# EAGLE design M221X (EAGLE 6.6.0)
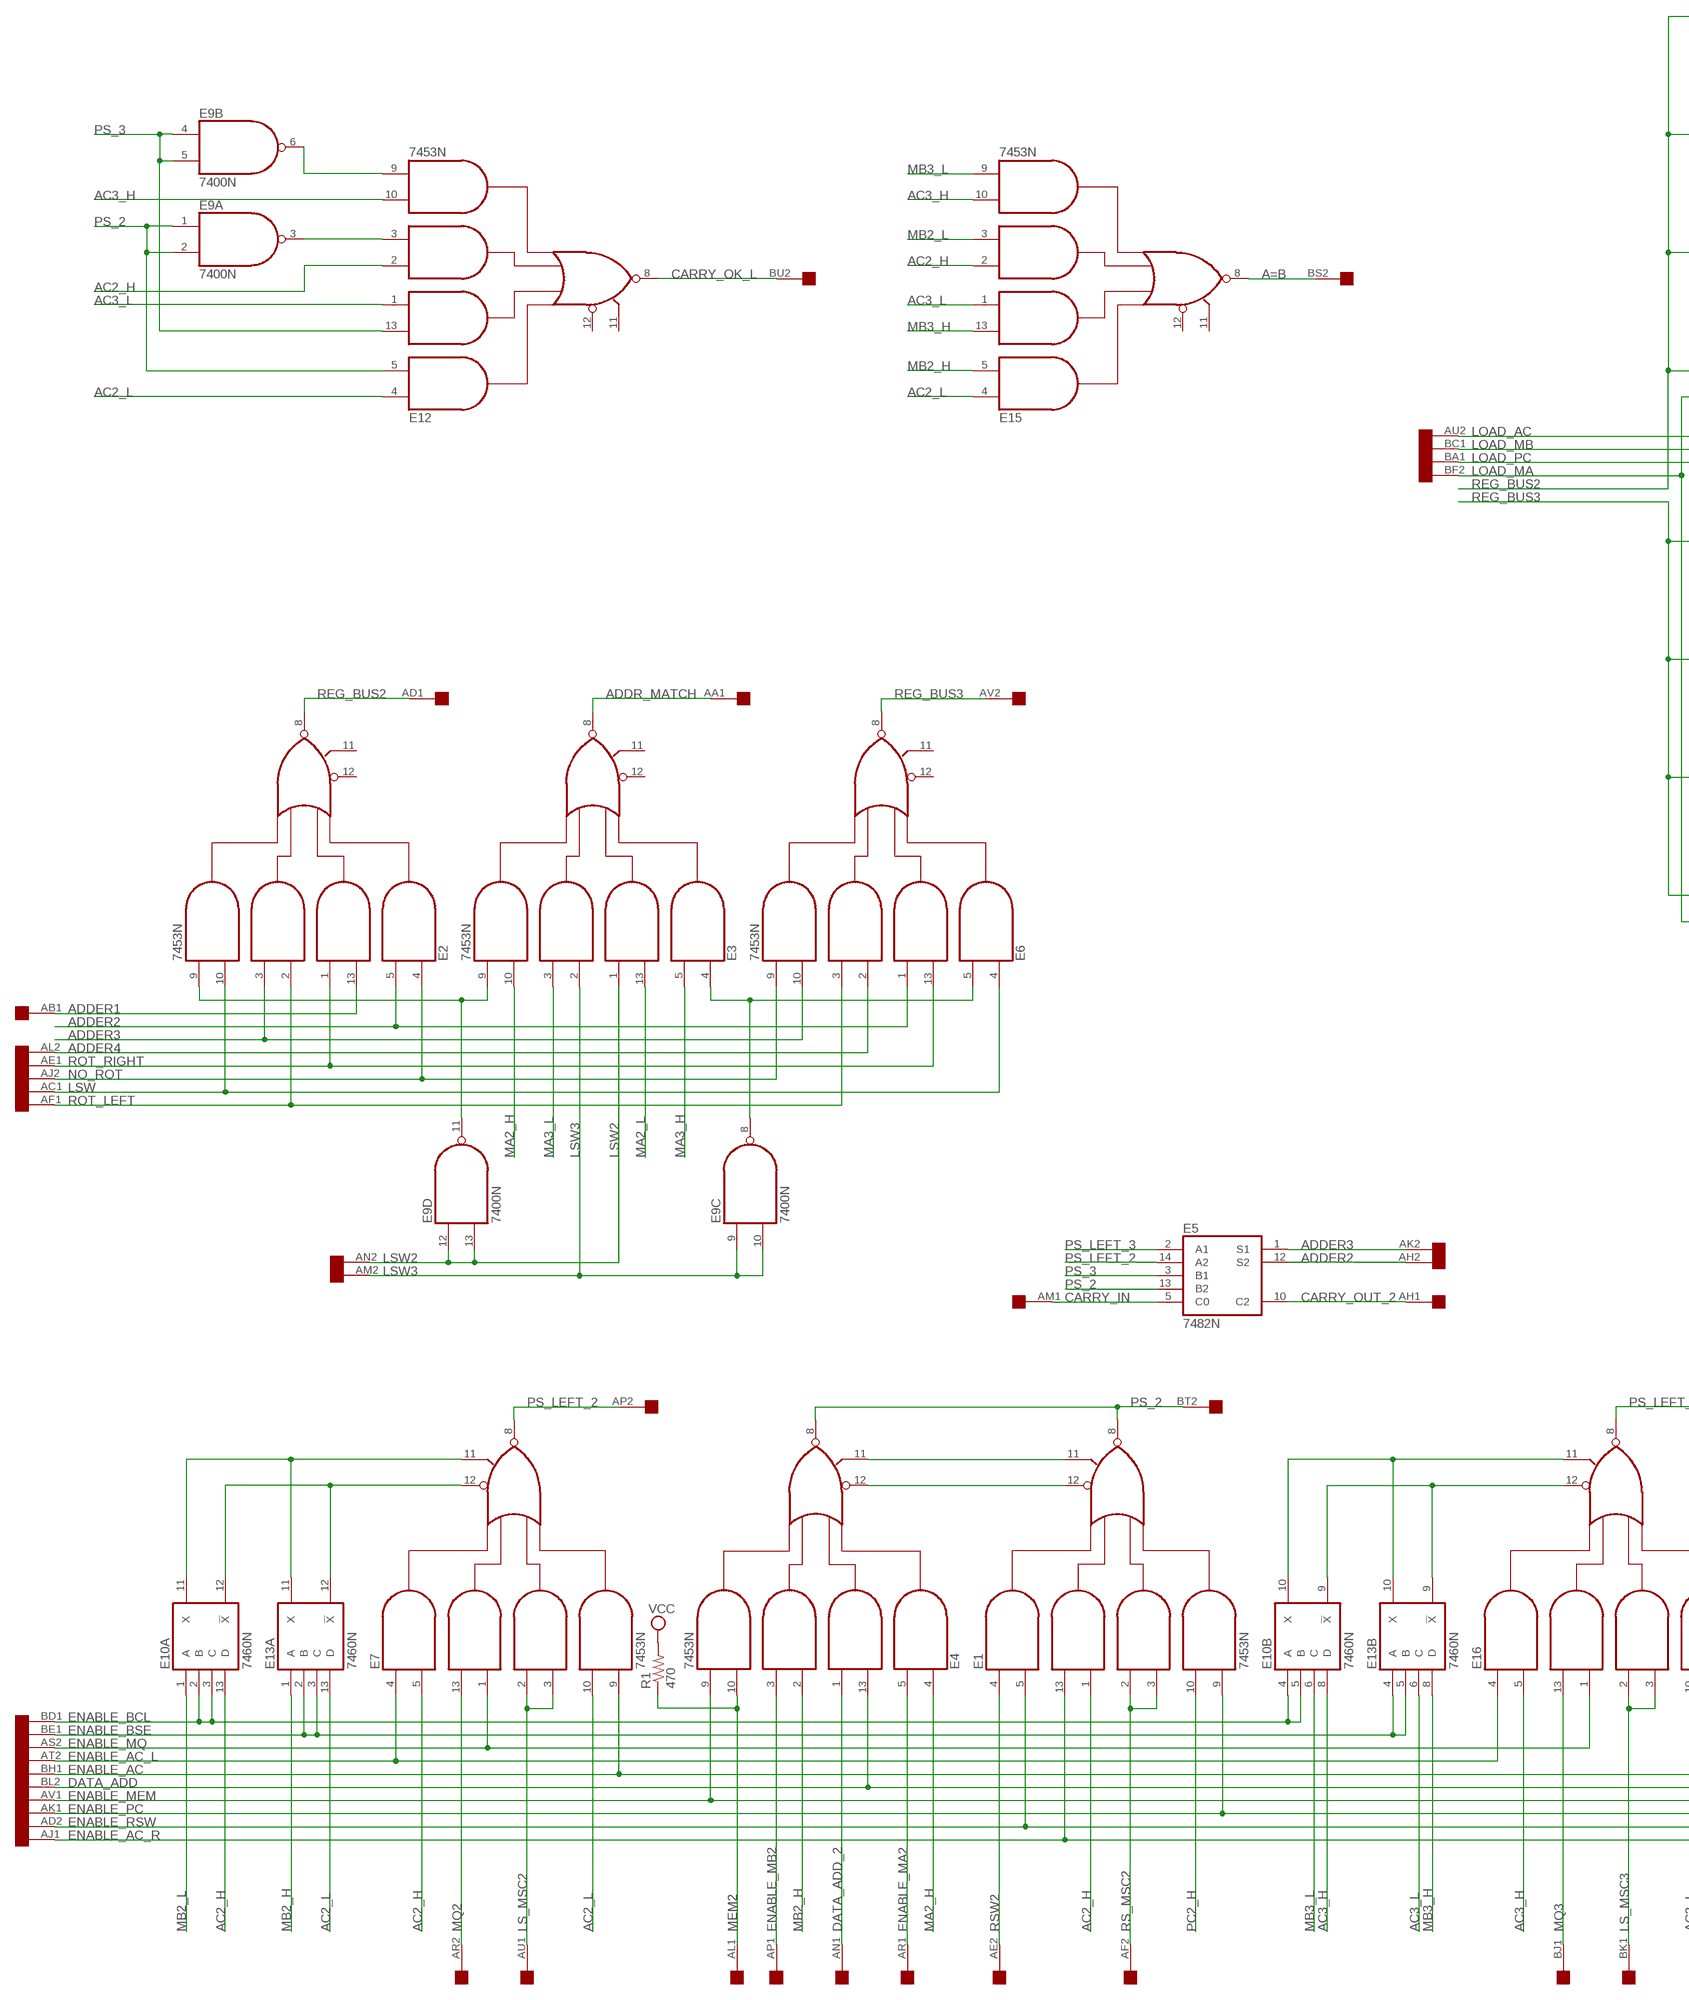
[diagram p0: schematic, sheet 1, part 1 of 2]
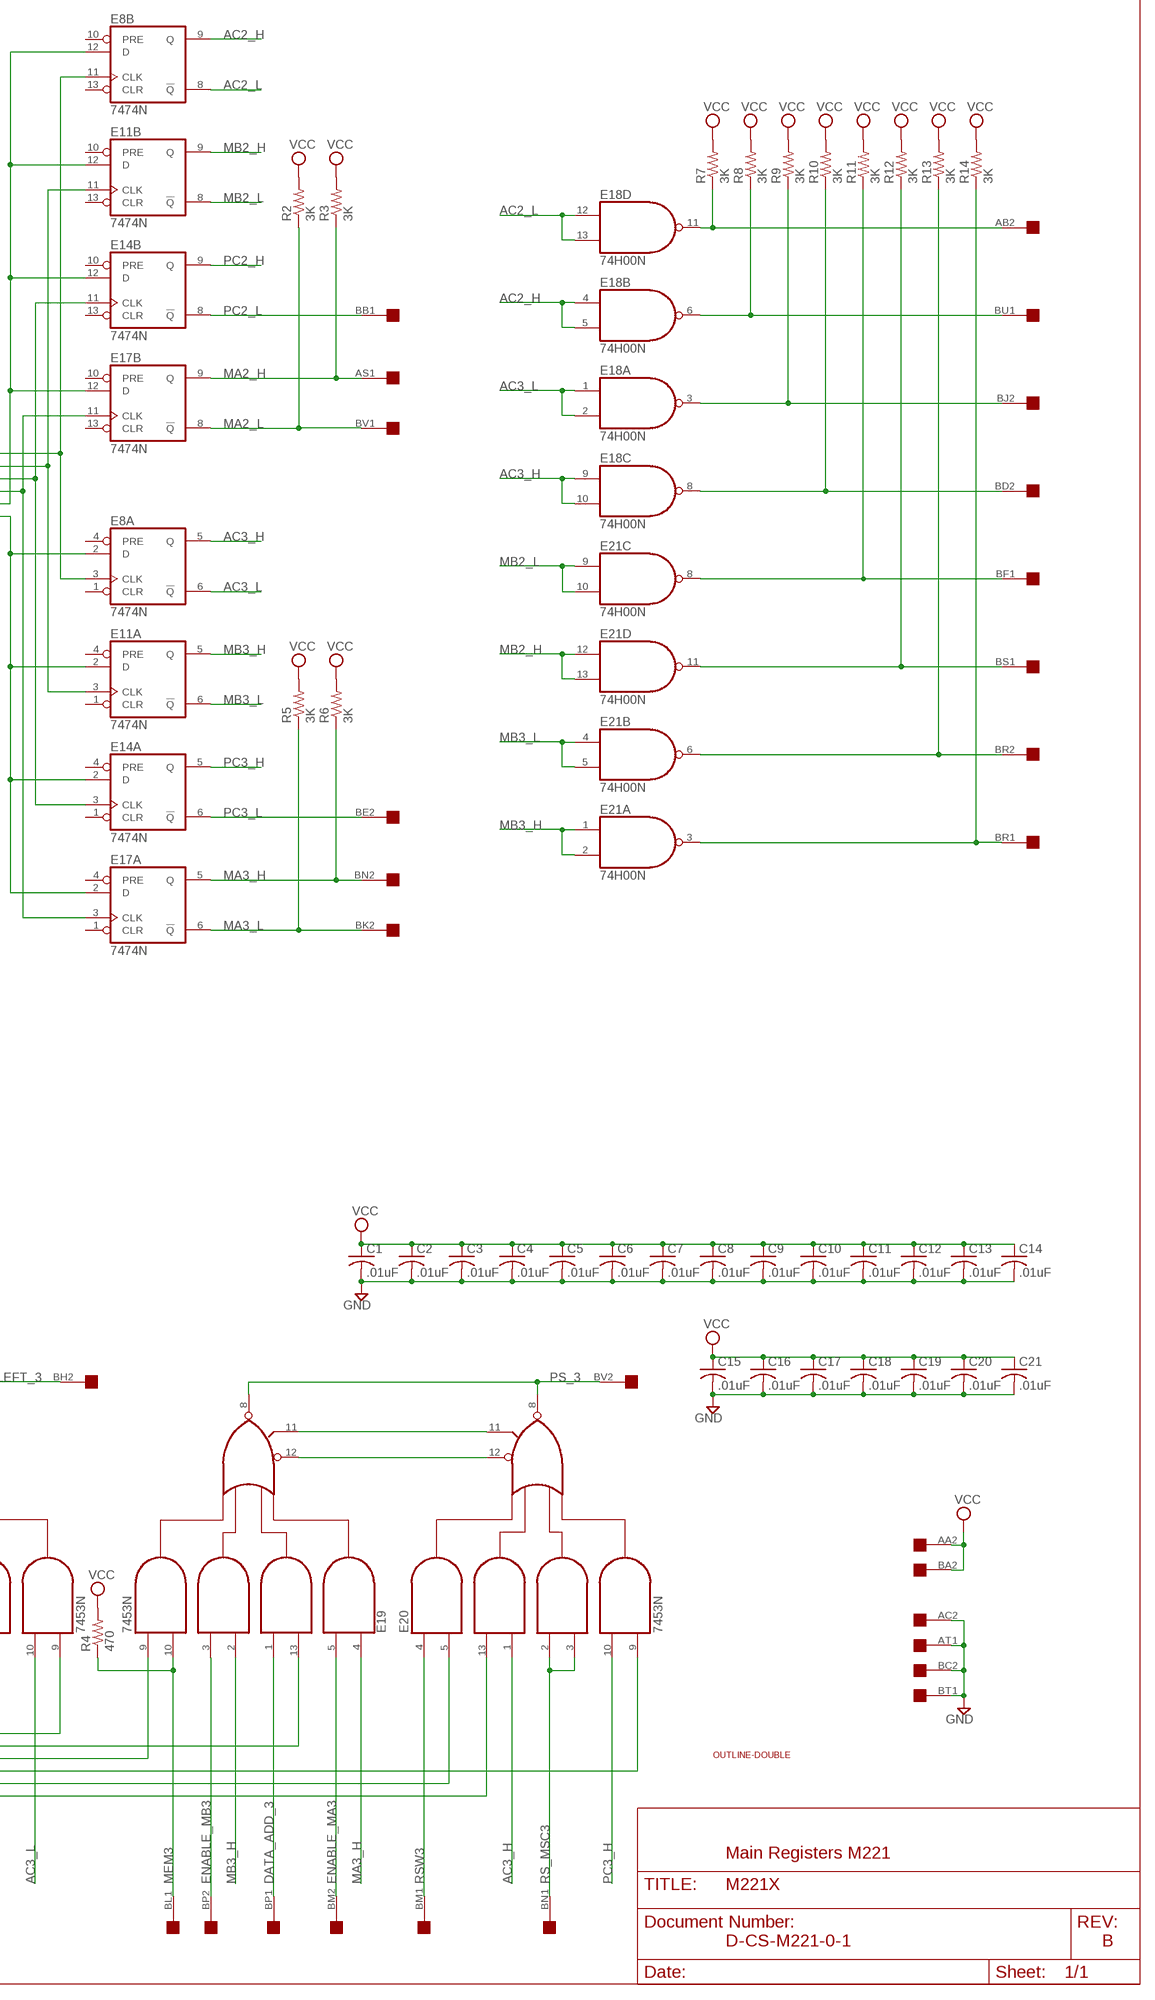
[diagram p1: schematic, sheet 1, part 2 of 2]

## Parts
C1  .01uF  C-US050-025X075  [C050-025X075]
C2  .01uF  C-US050-025X075  [C050-025X075]
C3  .01uF  C-US050-025X075  [C050-025X075]
C4  .01uF  C-US050-025X075  [C050-025X075]
C5  .01uF  C-US050-025X075  [C050-025X075]
C6  .01uF  C-US050-025X075  [C050-025X075]
C7  .01uF  C-US050-025X075  [C050-025X075]
C8  .01uF  C-US050-025X075  [C050-025X075]
C9  .01uF  C-US050-025X075  [C050-025X075]
C10  .01uF  C-US050-025X075  [C050-025X075]
C11  .01uF  C-US050-025X075  [C050-025X075]
C12  .01uF  C-US050-025X075  [C050-025X075]
C13  .01uF  C-US050-025X075  [C050-025X075]
C14  .01uF  C-US050-025X075  [C050-025X075]
C15  .01uF  C-US050-025X075  [C050-025X075]
C16  .01uF  C-US050-025X075  [C050-025X075]
C17  .01uF  C-US050-025X075  [C050-025X075]
C18  .01uF  C-US050-025X075  [C050-025X075]
C19  .01uF  C-US050-025X075  [C050-025X075]
C20  .01uF  C-US050-025X075  [C050-025X075]
C21  .01uF  C-US050-025X075  [C050-025X075]
E1  7453N  [DIL14]
E2  7453N  [DIL14]
E3  7453N  [DIL14]
E4  7453N  [DIL14]
E5  7482N  [DIL14]
E6  7453N  [DIL14]
E7  7453N  [DIL14]
E8  7474N  74S74N  [DIL14]
E9  7400N  [DIL14]
E10  7460N  [DIL14]
E11  7474N  74S74N  [DIL14]
E12  7453N  [DIL14]
E13  7460N  [DIL14]
E14  7474N  74S74N  [DIL14]
E15  7453N  [DIL14]
E16  7453N  [DIL14]
E17  7474N  74S74N  [DIL14]
E18  74H00N  7400N  [DIL14]
E19  7453N  [DIL14]
E20  7453N  [DIL14]
E21  74H00N  7400N  [DIL14]
R1  470  R-US_0207/10  [0207/10]
R2  3K  R-US_0207/10  [0207/10]
R3  3K  R-US_0207/10  [0207/10]
R4  470  R-US_0207/10  [0207/10]
R5  3K  R-US_0207/10  [0207/10]
R6  3K  R-US_0207/10  [0207/10]
R7  3K  R-US_0207/10  [0207/10]
R8  3K  R-US_0207/10  [0207/10]
R9  3K  R-US_0207/10  [0207/10]
R10  3K  R-US_0207/10  [0207/10]
R11  3K  R-US_0207/10  [0207/10]
R12  3K  R-US_0207/10  [0207/10]
R13  3K  R-US_0207/10  [0207/10]
R14  3K  R-US_0207/10  [0207/10]
U$1  DOUBLE  [EDGE-CON4]
U$2  OUTLINE-DOUBLE  [DOUBLE]

## Nets
!AC_2: E18.6(B:O) R8.1 U$1.BU1
!AC_3: E18.8(C:O) R10.1 U$1.BD2
!MB_2: E21.11(D:O) R12.1 U$1.BS1
!MB_3: E21.3(A:O) R14.1 U$1.BR1
A=B: E15.8(O) U$1.BS2
AC2_H: E1.1(I4) E7.5(I2) E8.9(B:Q) E10.13(A:D) E12.2(I5) E15.2(I5) E18.4(B:I0) E18.5(B:I1)
AC2_L: E7.10(I7) E8.8(B:!Q) E12.4(I1) E13.13(A:D) E15.4(I1) E18.12(D:I0) E18.13(D:I1)
AC3_H: E8.5(A:Q) E10.8(B:D) E12.10(I7) E15.10(I7) E16.5(I2) E18.9(C:I0) E18.10(C:I1) E20.1(I4)
AC3_L: E8.6(A:!Q) E12.1(I4) E13.6(B:C) E15.1(I4) E16.10(I7) E18.1(A:I0) E18.2(A:I1)
AC_2: E18.11(D:O) R7.1 U$1.AB2
AC_3: E18.3(A:O) R9.1 U$1.BJ2
ADDER1: E2.13(I3) U$1.AB1
ADDER2: E2.5(I2) E5.12(S2) E6.1(I4) U$1.AH2
ADDER3: E2.3(I6) E5.1(S1) E6.10(I7) U$1.AK2
ADDER4: E6.2(I5) U$1.AL2
ADDR_MATCH: E3.8(O) U$1.AA1
CARRY_IN: E5.5(C0) U$1.AM1
CARRY_OK_L: E12.8(O) U$1.BU2
CARRY_OUT_2: E5.10(C2) U$1.AH1
DATA_ADD: E4.13(I3) E19.13(I3) U$1.BL2
DATA_ADD_2: E4.1(I4) U$1.AN1
DATA_ADD_3: E19.1(I4) U$1.BP1
ENABLE_AC: E7.9(I8) E16.9(I8) U$1.BH1
ENABLE_AC_L: E7.4(I1) E16.4(I1) U$1.AT2
ENABLE_AC_R: E1.13(I3) E20.13(I3) U$1.AJ1
ENABLE_BCL: E10.2(A:B) E10.3(A:C) E10.4(B:A) E10.5(B:B) U$1.BD1
ENABLE_BSE: E13.2(A:B) E13.3(A:C) E13.4(B:A) E13.5(B:B) U$1.BE1
ENABLE_MA2: E4.5(I2) U$1.AR1
ENABLE_MA3: E19.5(I2) U$1.BM2
ENABLE_MB2: E4.3(I6) U$1.AP1
ENABLE_MB3: E19.3(I6) U$1.BP2
ENABLE_MEM: E4.9(I8) E19.9(I8) U$1.AV1
ENABLE_MQ: E7.1(I4) E16.1(I4) U$1.AS2
ENABLE_PC: E1.9(I8) E20.9(I8) U$1.AK1
ENABLE_RSW: E1.5(I2) E20.5(I2) U$1.AD2
GND [Supply]: C1.2 C2.2 C3.2 C4.2 C5.2 C6.2 C7.2 C8.2 C9.2 C10.2 C11.2 C12.2 C13.2 C14.2 C15.2 C16.2 C17.2 C18.2 C19.2 C20.2 C21.2 U$1.AC2 U$1.AT1 U$1.BC2 U$1.BT1
LOAD_AC: E8.3(A:CLK) E8.11(B:CLK) U$1.AU2
LOAD_MA: E17.3(A:CLK) E17.11(B:CLK) U$1.BF2
LOAD_MB: E11.3(A:CLK) E11.11(B:CLK) U$1.BC1
LOAD_PC: E14.3(A:CLK) E14.11(B:CLK) U$1.BA1
LS_MSC2: E7.2(I5) E7.3(I6) U$1.AU1
LS_MSC3: E16.2(I5) E16.3(I6) U$1.BK1
LSW: E2.10(I7) E6.4(I1) U$1.AC1
LSW2: E3.1(I4) E9.12(D:I0) E9.13(D:I1) U$1.AN2
LSW3: E3.2(I5) E9.9(C:I0) E9.10(C:I1) U$1.AM2
MA2_H: E3.10(I7) E4.4(I1) E17.9(B:Q) R3.1 U$1.AS1
MA2_L: E3.13(I3) E17.8(B:!Q) R2.1 U$1.BV1
MA3_H: E3.5(I2) E17.5(A:Q) E19.4(I1) R6.1 U$1.BN2
MA3_L: E3.3(I6) E17.6(A:!Q) R5.1 U$1.BK2
MB2_H: E4.2(I5) E11.9(B:Q) E13.1(A:A) E15.5(I2) E21.12(D:I0) E21.13(D:I1)
MB2_L: E10.1(A:A) E11.8(B:!Q) E15.3(I6) E21.9(C:I0) E21.10(C:I1)
MB3_H: E11.5(A:Q) E13.8(B:D) E15.13(I3) E19.2(I5) E21.1(A:I0) E21.2(A:I1)
MB3_L: E10.6(B:C) E11.6(A:!Q) E15.9(I8) E21.4(B:I0) E21.5(B:I1)
MB_2: E21.8(C:O) R11.1 U$1.BF1
MB_3: E21.6(B:O) R13.1 U$1.BR2
MEM2: E4.10(I7) R1.1 U$1.AL1
MEM3: E19.10(I7) R4.1 U$1.BL1
MQ2: E7.13(I3) U$1.AR2
MQ3: E16.13(I3) U$1.BJ1
N$1: E10.10(B:X) E13.10(B:X) E16.11(I10)
N$2: E10.9(B:!X) E13.9(B:!X) E16.12(I9)
N$3: E1.11(I10) E4.11(I10)
N$4: E1.12(I9) E4.12(I9)
N$5: E7.12(I9) E10.12(A:!X) E13.12(A:!X)
N$6: E7.11(I10) E10.11(A:X) E13.11(A:X)
N$7: E19.12(I9) E20.12(I9)
N$8: E19.11(I10) E20.11(I10)
N$9: E2.9(I8) E3.9(I8) E9.11(D:O)
N$10: E3.4(I1) E6.5(I2) E9.8(C:O)
N$19: E9.3(A:O) E12.3(I6)
N$20: E9.6(B:O) E12.9(I8)
NO_ROT: E2.4(I1) E6.9(I8) U$1.AJ2
PC2_H: E1.10(I7) E14.9(B:Q)
PC2_L: E14.8(B:!Q) U$1.BB1
PC3_H: E14.5(A:Q) E20.10(I7)
PC3_L: E14.6(A:!Q) U$1.BE2
PS_2: E1.8(O) E4.8(O) E5.13(B2) E9.1(A:I0) E9.2(A:I1) E12.5(I2) U$1.BT2
PS_3: E5.3(B1) E9.4(B:I0) E9.5(B:I1) E12.13(I3) E19.8(O) E20.8(O) U$1.BV2
PS_LEFT_2: E5.14(A2) E7.8(O) U$1.AP2
PS_LEFT_3: E5.2(A1) E16.8(O) U$1.BH2
REG_BUS2: E2.8(O) E8.12(B:D) E11.12(B:D) E14.12(B:D) E17.12(B:D) U$1.AD1
REG_BUS3: E6.8(O) E8.2(A:D) E11.2(A:D) E14.2(A:D) E17.2(A:D) U$1.AV2
ROT_LEFT: E2.2(I5) E6.3(I6) U$1.AF1
ROT_RIGHT: E2.1(I4) E6.13(I3) U$1.AE1
RS_MSC2: E1.2(I5) E1.3(I6) U$1.AF2
RS_MSC3: E20.2(I5) E20.3(I6) U$1.BN1
RSW2: E1.4(I1) U$1.AE2
RSW3: E20.4(I1) U$1.BM1
VCC [Supply]: C1.1 C2.1 C3.1 C4.1 C5.1 C6.1 C7.1 C8.1 C9.1 C10.1 C11.1 C12.1 C13.1 C14.1 C15.1 C16.1 C17.1 C18.1 C19.1 C20.1 C21.1 R1.2 R2.2 R3.2 R4.2 R5.2 R6.2 R7.2 R8.2 R9.2 R10.2 R11.2 R12.2 R13.2 R14.2 U$1.AA2 U$1.BA2
Unconnected: E1.6(SPARE) E2.6(SPARE) E2.11(I10) E2.12(I9) E3.6(SPARE) E3.11(I10) E3.12(I9) E4.6(SPARE) E5.6 E5.7 E5.8 E5.9 E6.6(SPARE) E6.11(I10) E6.12(I9) E7.6(SPARE) E8.1(A:CLR) E8.4(A:PRE) E8.10(B:PRE) E8.13(B:CLR) E11.1(A:CLR) E11.4(A:PRE) E11.10(B:PRE) E11.13(B:CLR) E12.6(SPARE) E12.11(I10) E12.12(I9) E14.1(A:CLR) E14.4(A:PRE) E14.10(B:PRE) E14.13(B:CLR) E15.6(SPARE) E15.11(I10) E15.12(I9) E16.6(SPARE) E17.1(A:CLR) E17.4(A:PRE) E17.10(B:PRE) E17.13(B:CLR) E19.6(SPARE) E20.6(SPARE) U$1.BB2

## Notes on the sheet
- Main Registers M221
- D-CS-M221-0-1 | B

## Power pins joined to a net without a drawn wire
GND: E1.7(GND) E2.7(GND) E3.7(GND) E4.7(GND) E5.11(GND) E6.7(GND) E7.7(GND) E8.7(P:GND) E9.7(P:GND) E10.7(P:GND) E11.7(P:GND) E12.7(GND) E13.7(P:GND) E14.7(P:GND) E15.7(GND) E16.7(GND) E17.7(P:GND) E18.7(P:GND) E19.7(GND) E20.7(GND) E21.7(P:GND)
VCC: E1.14(VCC) E2.14(VCC) E3.14(VCC) E4.14(VCC) E5.4(VCC) E6.14(VCC) E7.14(VCC) E8.14(P:VCC) E9.14(P:VCC) E10.14(P:VCC) E11.14(P:VCC) E12.14(VCC) E13.14(P:VCC) E14.14(P:VCC) E15.14(VCC) E16.14(VCC) E17.14(P:VCC) E18.14(P:VCC) E19.14(VCC) E20.14(VCC) E21.14(P:VCC)

## Library data of the parts
C1-C21 = rcl:C-US: CAPACITOR, American symbol
E1-E4 E6 E7 E12 E15 E16 E19 E20 = dec-con:74*53: 4-2-3-2 input AND OR INVERTER gates
E5 = dec-con:74*82: 2-bit binary full ADDER Has the wrong GND pin in other libraries.
E8 E11 E14 E17 = 74xx-us:74*74: Dual D type positive edge triggered FLIP FLOP, preset and clear
E9 E18 E21 = 74xx-us:74*00: Quad 2-input NAND gate
E10 E13 = 74xx-us:74*60: Dual 4-input EXPANDER
R1-R14 = rcl:R-US_: RESISTOR, American symbol
U$1 = dec-con:DOUBLE: Double-Height DEC board
U$2 = dec-con:OUTLINE-*: Board outlines for DEC boards.

## Net classes
1 Supply: width 0.813 mm

## Board
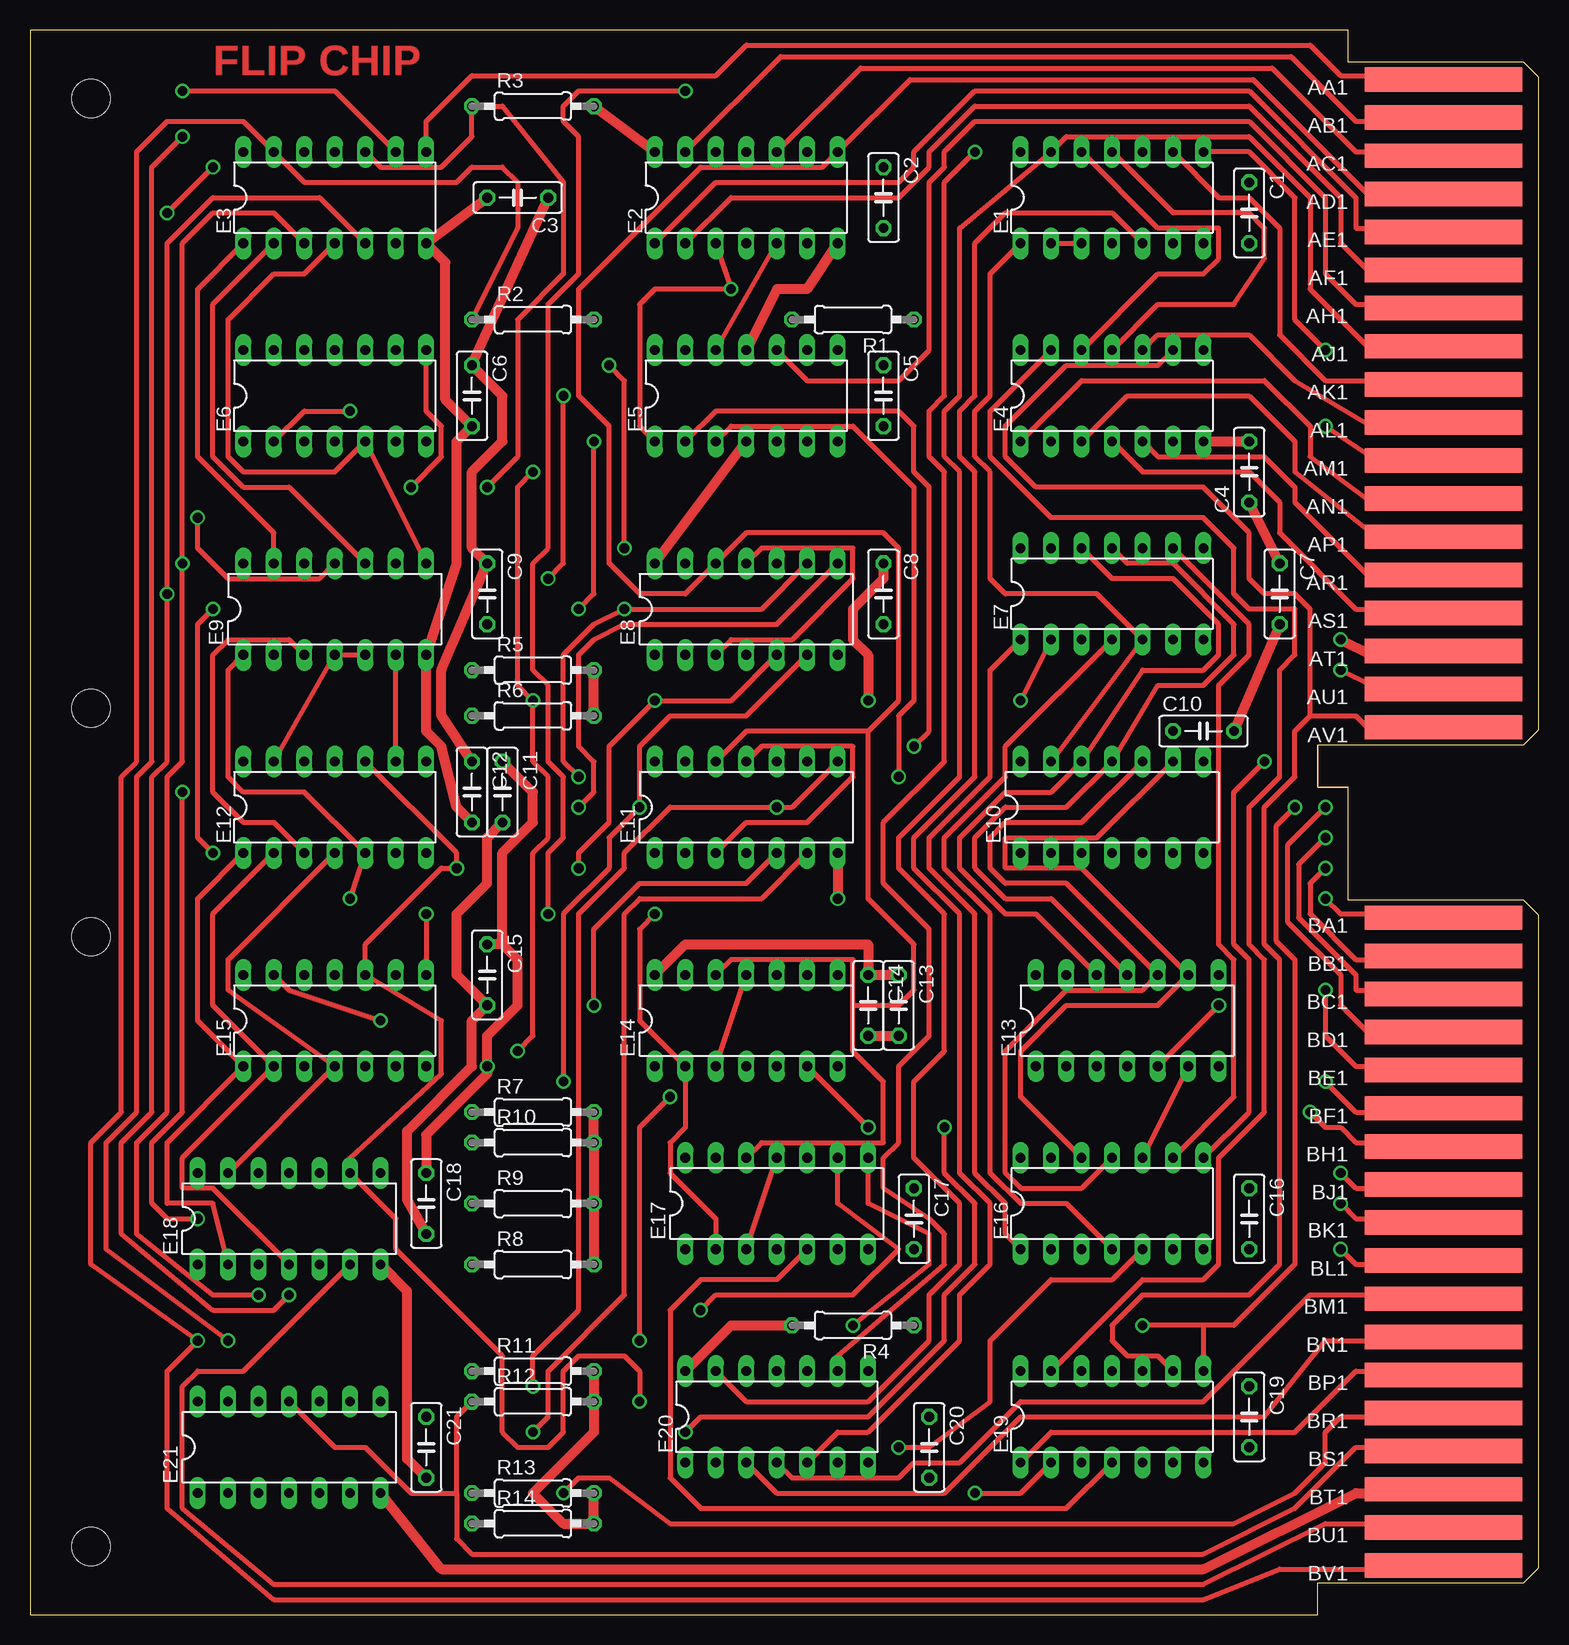
[diagram p2: board, top side]
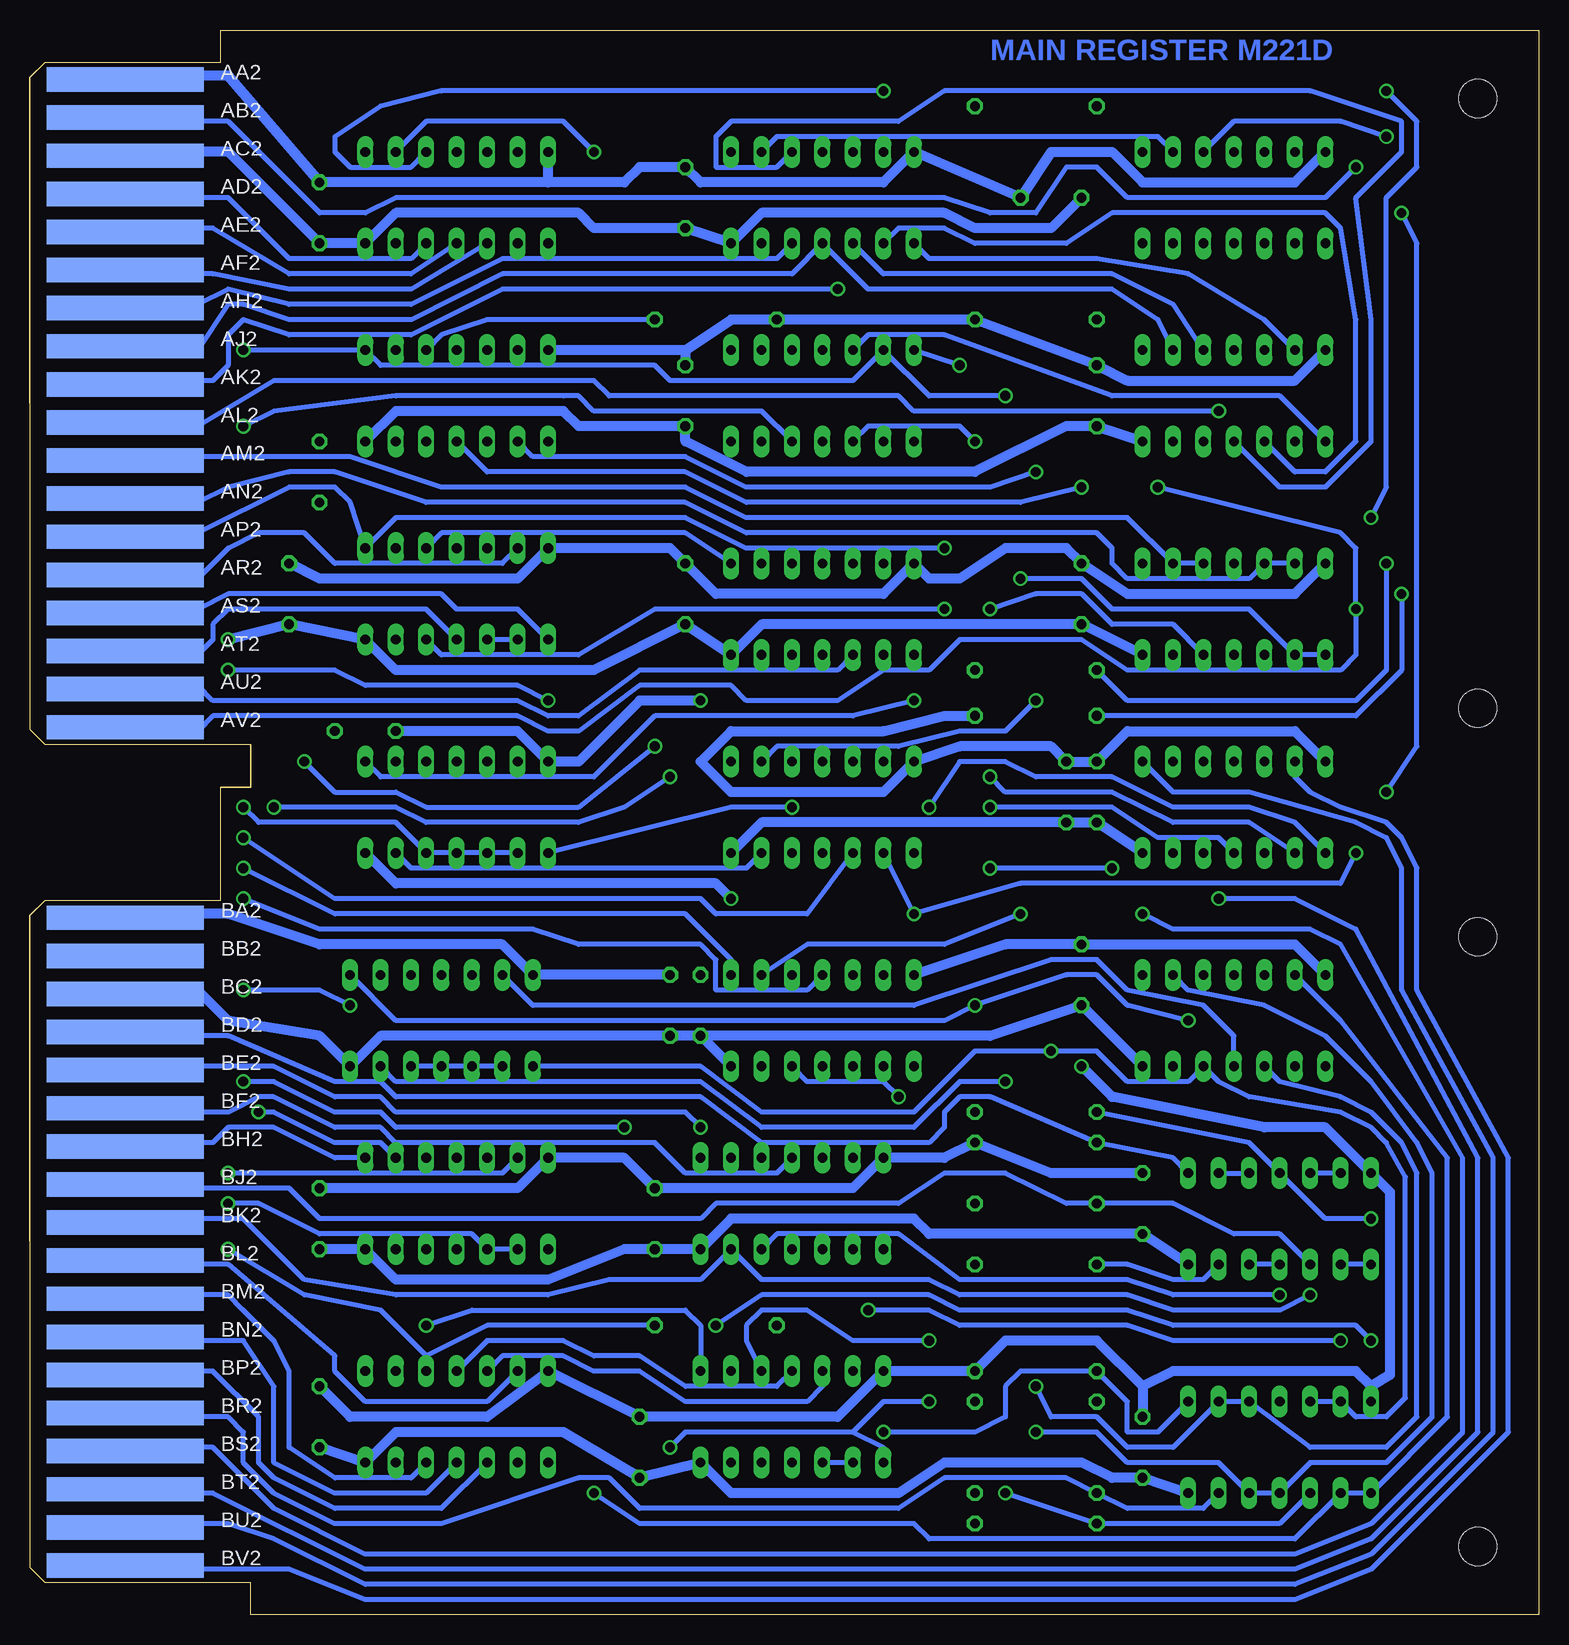
[diagram p3: board, bottom side, seen from below]

Size 125.73 x 132.08 mm. Coordinates in mm from the lower left corner, seen from the top.
Copper layers (1+16): Top 0.035mm / dielectric 1.5mm / Bottom 0.035mm
Design rules "16mils": minimum track width 16mil, minimum drill 32mil, track to track 15mil, track to pad 10mil, pad to pad 10mil, via to via 10mil, smd to smd 10mil, copper to edge 13mil, drill to drill 10mil, minimum pad ring 10mil, minimum via ring 8mil, stop-mask expansion 0mil, vias tented up to drill 0mil, thermal gap 10mil

### Footprints (pad centres in the part's own frame; a part is rotated, then mirrored left to right if it is on the bottom)
C050-025X075 = drill 0.813 octagon: 1 -2.54,0; 2 2.54,0
DIL14 = drill 0.813 long: 1 -7.62,-3.81; 2 -5.08,-3.81; 3 -2.54,-3.81; 4 0,-3.81; 5 2.54,-3.81; 6 5.08,-3.81; 7 7.62,-3.81; 8 7.62,3.81; 9 5.08,3.81; 10 2.54,3.81; 11 0,3.81; 12 -2.54,3.81; 13 -5.08,3.81; 14 -7.62,3.81
0207/10 = drill 0.813 octagon: 1 -5.08,0; 2 5.08,0
EDGE-CON4 = smd 13.106 x 2.032: AA1 7.938,4.128; AB1 7.938,7.303; AC1 7.938,10.477; AD1 7.938,13.652; AE1 7.938,16.828; AF1 7.938,20.003; AH1 7.938,23.177; AJ1 7.938,26.352; AK1 7.938,29.527; AL1 7.938,32.703; AM1 7.938,35.877; AN1 7.938,39.053; AP1 7.938,42.227; AR1 7.938,45.403; AS1 7.938,48.578; AT1 7.938,51.752; AU1 7.938,54.928; AV1 7.938,58.102; BA1 7.938,73.978; BB1 7.938,77.153; BC1 7.938,80.328; BD1 7.938,83.502; BE1 7.938,86.677; BF1 7.938,89.853; BH1 7.938,93.028; BJ1 7.938,96.203; BK1 7.938,99.377; BL1 7.938,102.552; BM1 7.938,105.728; BN1 7.938,108.903; BP1 7.938,112.078; BR1 7.938,115.252; BS1 7.938,118.427; BT1 7.938,121.603; BU1 7.938,124.778; BV1 7.938,127.953 | smd 13.106 x 2.032 bottom: AA2 7.938,4.128; AB2 7.938,7.303; AC2 7.938,10.477; AD2 7.938,13.652; AE2 7.938,16.828; AF2 7.938,20.003; AH2 7.938,23.177; AJ2 7.938,26.352; AK2 7.938,29.527; AL2 7.938,32.703; AM2 7.938,35.877; AN2 7.938,39.053; AP2 7.938,42.227; AR2 7.938,45.403; AS2 7.938,48.578; AT2 7.938,51.752; AU2 7.938,54.928; AV2 7.938,58.102; BA2 7.938,73.978; BB2 7.938,77.153; BC2 7.938,80.328; BD2 7.938,83.502; BE2 7.938,86.677; BF2 7.938,89.853; BH2 7.938,93.028; BJ2 7.938,96.203; BK2 7.938,99.377; BL2 7.938,102.552; BM2 7.938,105.728; BN2 7.938,108.903; BP2 7.938,112.078; BR2 7.938,115.252; BS2 7.938,118.427; BT2 7.938,121.603; BU2 7.938,124.778; BV2 7.938,127.953
DOUBLE = hole 3.175: 120.65,56.515; 120.65,5.715; 120.65,75.565; 120.65,126.365

### Placement (x,y rotation side)
C1  101.6,116.84 270 top
C2  71.12,118.11 270 top
C3  40.64,118.11 180 top
C4  101.6,95.25 90 top
C5  71.12,101.6 270 top
C6  36.83,101.6 270 top
C7  104.14,85.09 270 top
C8  71.12,85.09 270 top
C9  38.1,85.09 270 top
C10  97.79,73.66 0 top
C11  39.37,68.58 270 top
C12  36.83,68.58 270 top
C13  72.39,50.8 270 top
C14  69.85,50.8 270 top
C15  38.1,53.34 270 top
C16  101.6,33.02 270 top
C17  73.66,33.02 270 top
C18  33.02,34.29 270 top
C19  101.6,16.51 270 top
C20  74.93,13.97 270 top
C21  33.02,13.97 270 top
E1  90.17,118.11 0 top
E2  59.69,118.11 0 top
E3  25.4,118.11 0 top
E4  90.17,101.6 0 top
E5  59.69,101.6 0 top
E6  25.4,101.6 0 top
E7  90.17,85.09 0 top
E8  59.69,83.82 0 top
E9  25.4,83.82 0 top
E10  90.17,67.31 0 top
E11  59.69,67.31 0 top
E12  25.4,67.31 0 top
E13  91.44,49.53 0 top
E14  59.69,49.53 0 top
E15  25.4,49.53 0 top
E16  90.17,34.29 0 top
E17  62.23,34.29 0 top
E18  21.59,33.02 0 top
E19  90.17,16.51 0 top
E20  62.23,16.51 0 top
E21  21.59,13.97 0 top
R1  68.58,107.95 180 top
R2  41.91,107.95 0 top
R3  41.91,125.73 0 top
R4  68.58,24.13 180 top
R5  41.91,78.74 0 top
R6  41.91,74.93 0 top
R7  41.91,41.91 0 top
R8  41.91,29.21 0 top
R9  41.91,34.29 0 top
R10  41.91,39.37 0 top
R11  41.91,20.32 0 top
R12  41.91,17.78 0 top
R13  41.91,10.16 0 top
R14  41.91,7.62 0 top
U$1  125.73,132.08 180 top
U$2  125.73,132.08 180 top

### Tracks (layer width: path | path; a pad name or v marks a point on that pad's centre or on a via)
!AC_2
  Top 0.406: U$1.BU1 116.84,7.62 107.95,7.62 97.79,2.54 20.32,2.54 12.7,8.89 12.7,19.05 13.97,20.32 17.78,20.32 E18.6
  Bottom 0.406: E18.6 27.94,27.94 30.48,27.94 34.29,29.21 R8.1
!AC_3
  Bottom 0.406: E18.8 30.48,38.1 R10.1 45.72,43.18 48.26,43.18 49.53,41.91 49.53,40.64 50.8,39.37 64.77,39.37 69.85,43.18 95.25,43.18 96.52,44.45 100.33,44.45 109.22,48.26 116.84,48.26 U$1.BD2
!MB_2
  Top 0.406: E21.11 25.4,13.97 27.94,13.97 31.75,10.16 35.56,10.16 | 35.56,10.16 35.56,16.51 R12.1 | 35.56,10.16 35.56,6.35 36.83,5.08 97.79,5.08 105.41,8.89 110.49,13.97 116.84,13.97 U$1.BS1
!MB_3  (via drill 0.81)
  Top 0.406: U$1.BR1 116.84,16.51 109.22,16.51 107.95,15.24 107.95,12.7 105.41,10.16 100.33,7.62 53.34,7.62 48.26,11.43 45.72,11.43 v44.45,10.16
  Bottom 0.406: E21.3 21.59,7.62 R14.1 v44.45,10.16
A=B  (via drill 0.81)
  Top 0.406: v33.02,58.42 E15.8
  Bottom 0.406: U$1.BS2 116.84,13.97 110.49,13.97 105.41,8.89 97.79,5.08 20.32,5.08 13.97,7.62 6.35,15.24 6.35,38.1 16.51,55.88 19.05,57.15 30.48,57.15 v33.02,58.42
AC2_H  (via drill 0.81)
  Top 0.406: E10.13 E7.5 88.9,85.09 81.28,85.09 80.01,86.36 80.01,95.25 78.74,96.52 78.74,100.33 80.01,101.6 80.01,111.76 E1.1 | E12.2 15.24,58.42 15.24,50.8 E15.2 12.7,38.1 12.7,35.56 15.24,35.56 E18.4 | v45.72,69.85 44.45,71.12 44.45,80.01 46.99,82.55 v49.53,83.82 60.96,83.82 E8.9
  Bottom 0.406: E18.4 E18.5 | E12.2 24.13,66.04 30.48,66.04 35.56,68.58 44.45,68.58 v45.72,69.85 | v49.53,83.82 73.66,83.82 80.01,80.01 91.44,80.01 E7.5
AC2_L  (via drill 0.81)
  Top 0.406: E12.4 16.51,54.61 16.51,52.07 E15.4 E18.13 | v45.72,67.31 46.99,68.58 46.99,71.12 45.72,72.39 45.72,80.01 46.99,81.28 49.53,82.55 62.23,82.55 E8.8
  Bottom 0.406: E18.13 E18.12 | E15.4 25.4,48.26 27.94,50.8 34.29,52.07 36.83,54.61 40.64,54.61 52.07,50.8 83.82,50.8 E13.13 | E12.4 26.67,64.77 31.75,64.77 35.56,67.31 v45.72,67.31 | E8.8 71.12,90.17 91.44,90.17 E7.10
AC3_H  (via drill 0.81)
  Top 0.406: v50.8,17.78 50.8,20.32 49.53,21.59 45.72,21.59 44.45,20.32 44.45,15.24 43.18,13.97 40.64,13.97 39.37,15.24 39.37,21.59 30.48,30.48 30.48,33.02 E18.9 26.67,38.1 34.29,45.09 34.29,49.53 E15.10 27.94,55.88 34.29,62.23 v35.56,62.23 35.56,63.5 E12.10 | v72.39,13.97 74.93,13.97 80.01,17.78 80.01,22.86 85.09,27.94 90.17,27.94 E16.5 | v45.72,62.23 45.72,63.5 48.26,66.04 48.26,72.39 v52.07,76.2 58.42,76.2 E8.5
  Bottom 0.406: E18.9 E18.10 | E20.1 54.61,13.97 57.15,15.24 | 57.15,15.24 54.61,17.78 v50.8,17.78 | 57.15,15.24 71.12,15.24 v72.39,13.97 | v35.56,62.23 v45.72,62.23 | E10.8 96.52,69.85 78.74,69.85 73.66,74.93 57.15,74.93 v52.07,76.2
AC3_L  (via drill 0.81)
  Top 0.406: E13.6 E16.10 | E12.1 13.97,59.69 13.97,49.53 E15.1 11.43,39.37 11.43,34.29 15.24,34.29 E18.2 | v44.45,44.45 44.45,58.42 48.26,62.23 48.26,64.77 v50.8,67.31 50.8,72.39 53.34,74.93 59.69,74.93 E8.6
  Bottom 0.406: E18.1 E18.2 | E12.1 20.32,66.04 24.13,67.31 30.48,67.31 35.56,69.85 41.91,69.85 44.45,71.12 48.26,71.12 v50.8,67.31 | E13.6 95.25,44.45 69.85,44.45 64.77,40.64 52.07,40.64 48.26,44.45 v44.45,44.45
AC_2  (via drill 0.81)
  Top 0.406: v11.43,116.84 v15.24,120.65 | v13.97,33.02 11.43,33.02 10.16,34.29 10.16,39.37 12.7,41.91 v12.7,68.58
  Bottom 0.406: U$1.AB2 116.84,124.46 109.22,124.46 101.6,116.84 97.79,116.84 95.25,118.11 49.53,118.11 45.72,116.84 41.91,116.84 39.37,120.65 36.83,120.65 34.29,118.11 17.78,118.11 v15.24,120.65 | R7.1 24.13,39.37 E18.11 17.78,33.02 v13.97,33.02 | v12.7,68.58 10.16,72.39 10.16,114.3 v11.43,116.84
AC_3
  Bottom 0.406: U$1.BJ2 116.84,35.56 104.14,35.56 101.6,33.02 69.85,33.02 68.58,34.29 53.34,34.29 49.53,36.83 44.45,36.83 39.37,34.29 R9.1 30.48,34.29 25.4,31.75 21.59,31.75 E18.3
ADDER1
  Top 0.406: U$1.AB1 116.84,124.46 110.49,124.46 105.09,129.86 62.55,129.86 E2.13
ADDER2
  Top 0.406: E5.12 E2.5
  Bottom 0.406: U$1.AH2 116.84,109.22 111.76,109.22 109.22,110.49 104.14,109.22 93.98,109.22 86.36,113.03 63.5,113.03 E2.5 | E6.1 21.59,101.6 35.56,101.6 49.53,106.68 55.88,106.68 E5.12
ADDER3  (via drill 0.81)
  Top 0.406: E2.3 v58.42,110.49 52.07,110.49 50.8,109.22 50.8,99.06 E5.1
  Bottom 0.406: U$1.AK2 115.57,102.87 110.49,102.87 109.22,104.14 109.22,106.68 107.95,107.95 104.14,106.68 93.98,106.68 86.36,110.49 v58.42,110.49 | E6.10 30.48,109.22 35.56,111.76 54.61,111.76 E2.3
ADDER4  (via drill 0.81)
  Top 0.406: v26.67,100.33 22.86,100.33 E6.2
  Bottom 0.406: U$1.AL2 116.84,99.06 111.76,99.06 105.41,102.87 78.74,102.87 77.47,101.6 53.34,101.6 52.07,100.33 v26.67,100.33
ADDR_MATCH
  Top 0.406: U$1.AA1 116.84,128.27 109.22,128.27 106.68,130.81 59.69,130.81 57.15,128.27 36.83,128.27 33.02,124.46 E3.8
CARRY_IN  (via drill 0.81)
  Top 0.406: U$1.AM1 116.84,96.52 111.76,96.52 v107.95,99.06
  Bottom 0.406: E5.5 64.77,100.33 78.74,100.33 80.01,101.6 81.28,101.6 95.25,101.6 105.41,100.33 v107.95,99.06
CARRY_OK_L
  Bottom 0.406: U$1.BU2 116.84,7.62 109.22,7.62 105.41,6.35 97.79,2.54 20.32,2.54 13.97,5.08 3.81,15.24 3.81,38.1 11.43,52.07 11.43,62.23 12.7,64.77 15.24,66.04 24.13,68.58 30.48,68.58 E12.8
CARRY_OUT_2
  Top 0.406: E5.10 64.77,102.87 72.39,102.87 74.93,105.41 74.93,119.38 76.2,120.65 76.2,121.92 78.74,124.46 101.6,124.46 107.95,118.11 107.95,111.76 110.49,109.22 116.84,109.22 U$1.AH1
DATA_ADD
  Top 0.406: E19.13 92.71,27.94 97.79,27.94 99.06,29.21 99.06,38.1 102.87,41.91 102.87,54.61 101.6,55.88 101.6,67.31 104.14,69.85 104.14,78.74 105.41,80.01 105.41,83.82 101.6,83.82 100.33,85.09 100.33,88.9 97.79,91.44 85.09,91.44 80.01,96.52 80.01,100.33 E4.13
  Bottom 0.406: E19.13 87.63,17.78 97.79,17.78 100.33,20.32 100.33,21.59 109.22,29.21 116.84,29.21 U$1.BL2
DATA_ADD_2
  Top 0.406: U$1.AN1 116.84,92.71 111.76,92.71 106.68,96.52 106.68,99.06 102.87,102.87 87.63,102.87 E4.1
DATA_ADD_3
  Top 0.406: U$1.BP1 116.84,20.32 110.49,20.32 105.41,15.24 85.09,15.24 E19.1
ENABLE_AC  (via drill 0.81)
  Top 0.406: U$1.BH1 116.84,39.37 110.49,39.37 109.22,40.64 107.95,40.64 v106.68,41.91 | E16.9 100.33,43.18 100.33,54.61 99.06,55.88 99.06,77.47 101.6,80.01 101.6,82.55 E7.9
  Bottom 0.406: E16.9 96.52,39.37 100.33,39.37 105.41,41.91 v106.68,41.91
ENABLE_AC_L
  Top 0.406: E16.4 86.36,34.29 82.55,34.29 80.01,36.83 80.01,58.42 76.2,62.23 76.2,64.77 81.28,69.85 81.28,72.39 E7.4
  Bottom 0.406: E7.4 92.71,83.82 109.22,83.82 110.49,82.55 110.49,81.28 111.76,80.01 116.84,80.01 U$1.AT2
ENABLE_AC_R
  Top 0.406: E20.13 59.69,17.78 69.85,17.78 74.93,22.86 74.93,26.67 77.47,29.21 77.47,34.29 73.66,38.1 73.66,44.45 76.2,46.99 76.2,58.42 72.39,62.23 72.39,64.77 77.47,69.85 77.47,95.25 76.2,96.52 76.2,100.33 77.47,101.6 77.47,115.57 E1.13 86.36,123.19 101.6,123.19 106.68,118.11 106.68,110.49 111.76,105.41 116.84,105.41 U$1.AJ1
ENABLE_BCL  (via drill 0.81)
  Top 0.406: U$1.BD1 111.76,48.26 109.22,50.8 109.22,53.34 104.78,57.78 104.78,64.14 v107.95,67.31
  Bottom 0.406: E10.2 E10.3 E10.4 E10.5 95.25,66.04 106.68,66.04 v107.95,67.31
ENABLE_BSE  (via drill 0.81)
  Top 0.406: U$1.BE1 116.84,45.72 110.49,45.72 107.95,48.26 v107.95,52.07 | E13.5 v99.06,50.8
  Bottom 0.406: E13.2 E13.3 E13.4 E13.5 | v99.06,50.8 101.6,52.07 v107.95,52.07
ENABLE_MA2
  Top 0.406: E4.5 93.98,96.52 102.87,96.52 105.41,93.98 105.41,92.71 111.76,86.36 116.84,86.36 U$1.AR1
ENABLE_MA3
  Bottom 0.406: E19.5 93.98,11.43 100.33,11.43 104.14,13.97 104.14,20.32 105.41,22.86 107.95,25.4 109.22,26.67 115.57,26.67 U$1.BM2
ENABLE_MB2
  Top 0.406: U$1.AP1 116.84,90.17 111.76,90.17 105.41,95.25 105.41,97.79 101.6,101.6 91.44,101.6 E4.3
ENABLE_MB3
  Bottom 0.406: U$1.BP2 116.84,20.32 110.49,20.32 106.68,16.51 106.68,12.7 105.41,11.43 100.33,8.89 91.44,8.89 E19.3
ENABLE_MEM
  Top 0.406: E19.9 93.98,21.59 91.44,21.59 90.17,22.86 90.17,24.13 92.71,26.67 101.6,26.67 104.14,29.21 104.14,54.61 102.87,55.88 102.87,67.31 105.41,69.85 105.41,73.66 106.68,74.93 | 106.68,74.93 106.68,83.82 105.41,85.09 102.87,85.09 101.6,86.36 101.6,90.17 97.79,93.98 83.82,93.98 81.28,96.52 81.28,99.06 86.36,104.14 93.98,104.14 E4.9 | U$1.AV1 116.84,73.66 111.76,73.66 110.49,74.93 106.68,74.93
ENABLE_MQ
  Top 0.406: E7.1 80.01,78.74 80.01,69.85 74.93,64.77 74.93,62.23 78.74,58.42 78.74,36.83 81.28,34.29 81.28,31.75 E16.1
  Bottom 0.406: E7.1 85.09,83.82 90.17,83.82 91.44,85.09 109.22,85.09 111.76,83.82 116.84,83.82 U$1.AS2
ENABLE_PC  (via drill 0.81)
  Top 0.406: E20.9 67.31,21.59 76.2,29.21 76.2,31.75 74.93,33.02 71.12,35.56 71.12,38.1 72.39,39.37 72.39,45.72 74.93,48.26 74.93,57.15 71.12,60.96 71.12,66.04 76.2,71.12 76.2,95.25 74.93,96.52 74.93,100.33 76.2,101.6 76.2,119.38 v78.74,121.92 | E1.9 99.06,118.11 101.6,118.11 104.14,115.57 104.14,106.68 107.95,102.87 116.84,102.87 U$1.AK1
  Bottom 0.406: E1.9 92.71,124.46 81.28,124.46 v78.74,121.92
ENABLE_RSW
  Top 0.406: E20.5 67.31,15.24 69.85,15.24 77.47,22.86 77.47,26.67 80.01,29.21 80.01,34.29 77.47,36.83 77.47,58.42 73.66,62.23 73.66,64.77 78.74,69.85 78.74,95.25 77.47,96.52 77.47,100.33 78.74,101.6 78.74,114.3 81.28,116.84 90.17,116.84 E1.5
  Bottom 0.406: U$1.AD2 116.84,118.11 109.22,118.11 104.14,113.03 93.98,113.03 E1.5
GND  (via drill 0.81)
  Top 0.813: U$1.BT1 116.84,10.16 110.49,10.16 97.79,3.81 34.29,3.81 E21.7 | C3.2 E3.7 34.61,112.71 34.61,101.28 C6.2 35.56,97.79 35.56,87.63 E9.7 33.02,73.66 34.29,72.39 35.56,67.31 C12.2 | C7.2 C10.2 | E4.7 C4.2 | E11.7 v67.31,59.69 | C14.2 C13.2 | E18.7 31.43,26.99 31.43,13.02 C21.2 | C11.2 38.1,64.77 38.1,60.96 35.56,58.42 35.56,53.34 C15.2 36.83,49.53 36.83,45.72 31.43,40.32 31.43,34.61 C18.2 | U$1.AT1 116.84,80.01 111.76,80.01 v109.22,81.28 | E5.11 62.23,110.49 64.77,110.49 E2.7
  Bottom 0.813: E21.7 C21.2 35.56,11.43 38.1,12.7 49.53,12.7 53.34,10.16 67.31,10.16 E20.7 C20.2 81.28,15.24 95.25,15.24 E19.7 C19.2 | U$1.AC2 116.84,121.92 109.22,121.92 C1.2 E1.7 95.25,116.84 80.01,116.84 78.74,115.57 C2.2 E2.7 64.77,116.84 49.53,116.84 46.99,115.57 40.64,115.57 C3.2 | E18.7 C18.2 50.8,31.75 52.07,33.02 67.31,33.02 E17.7 C17.2 76.2,30.48 82.55,27.94 95.25,27.94 E16.7 C16.2 | E15.7 C15.2 45.72,48.26 C14.2 | E12.7 C12.2 C11.2 64.77,66.04 E11.7 | E9.7 C9.2 64.77,82.55 E8.7 C8.2 78.74,78.74 95.25,78.74 E7.7 C7.2 v109.22,81.28 | E6.7 C6.2 39.37,99.06 46.99,95.25 66.04,95.25 71.12,97.79 C5.2 80.01,99.06 81.28,100.33 95.25,100.33 E4.7 | C14.2 C13.2 96.52,48.26 E13.7 101.6,48.26 109.22,49.53 111.76,52.07 116.84,52.07 U$1.BC2 | C14.2 E14.7 | E10.7 95.25,60.96 68.58,60.96 v67.31,59.69
LOAD_AC
  Top 0.406: E8.11 60.96,88.9 68.58,88.9 68.58,86.36 63.5,81.28 58.42,81.28 E8.3
  Bottom 0.406: E8.3 58.42,78.74 74.93,78.74 80.01,74.93 82.55,74.93 85.09,76.2 110.49,76.2 111.76,77.47 116.84,77.47 U$1.AU2
LOAD_MA
  Top 0.406: E17.3 E17.11
  Bottom 0.406: E17.11 63.5,36.83 71.12,36.83 73.66,39.37 95.25,39.37 96.52,40.64 100.33,40.64 105.41,43.18 106.68,43.18 109.22,41.91 116.84,41.91 U$1.BF2
LOAD_MB  (via drill 0.81)
  Top 0.406: U$1.BC1 116.84,52.07 110.49,52.07 110.49,53.34 105.73,58.1 105.73,62.55 v107.95,64.77 | E11.11 60.96,72.39 68.58,72.39 68.58,69.85 64.77,66.04 59.69,66.04 E11.3
  Bottom 0.406: E11.3 60.96,58.42 68.58,58.42 69.85,59.69 100.33,59.69 v107.95,64.77
LOAD_PC  (via drill 0.81)
  Top 0.406: U$1.BA1 116.84,58.42 109.22,58.42 v107.95,59.69 | E14.3 E14.11
  Bottom 0.406: E14.11 60.96,52.07 68.58,52.07 68.58,54.61 69.85,55.88 80.01,55.88 83.82,57.15 101.6,57.15 v107.95,59.69
LS_MSC2  (via drill 0.81)
  Top 0.406: v82.55,76.2 E7.2 | U$1.AU1 116.84,77.47 111.76,77.47 v109.22,78.74
  Bottom 0.406: E7.2 E7.3 | v109.22,78.74 100.33,78.74 97.79,77.47 85.09,77.47 v82.55,76.2
LS_MSC3  (via drill 0.81)
  Top 0.406: U$1.BK1 116.84,33.02 110.49,33.02 v109.22,34.29
  Bottom 0.406: E16.2 E16.3 88.9,31.75 101.6,31.75 106.68,34.29 v109.22,34.29
LSW
  Top 0.406: U$1.AC1 116.84,121.92 110.49,121.92 103.5,128.91 69.22,128.91 E2.10
  Bottom 0.406: E2.10 63.5,120.65 68.58,120.65 68.58,123.19 67.31,124.46 53.34,124.46 49.53,127 19.05,127 11.43,124.46 11.43,121.92 15.24,118.11 13.97,107.95 13.97,97.79 17.78,93.98 21.59,93.98 E6.4
LSW2
  Top 0.406: E3.1 13.97,110.49 13.97,96.52 20.32,90.17 E9.13
  Bottom 0.406: E9.13 E9.12 24.13,86.36 34.29,86.36 35.56,87.63 35.56,88.9 36.83,90.17 66.04,90.17 71.12,92.71 92.71,92.71 100.33,95.25 104.14,95.25 109.22,93.98 111.76,92.71 116.84,92.71 U$1.AN2
LSW3
  Top 0.406: E3.2 15.24,109.22 15.24,96.52 17.78,93.98 21.59,93.98 E9.10
  Bottom 0.406: E9.10 E9.9 34.29,91.44 66.04,91.44 71.12,93.98 91.44,93.98 99.06,96.52 116.84,96.52 U$1.AM2
MA2_H  (via drill 0.81)
  Top 0.406: E3.10 29.21,120.65 34.29,120.65 36.83,123.19 R3.1 39.37,125.73 44.45,119.38 44.45,111.76 40.64,107.95 40.64,96.52 v38.1,93.98 | v12.7,123.19 10.16,120.65 10.16,71.12 8.89,69.85 8.89,41.91 6.35,39.37 6.35,30.48 v16.51,22.86 | v55.88,25.4 57.15,26.67 68.58,26.67 72.39,30.48 67.31,34.29 E17.9 | E4.4 92.71,95.25 101.6,95.25 104.14,92.71 104.14,90.17 110.49,83.82 116.84,83.82 U$1.AS1
  Bottom 0.406: E3.10 25.4,124.46 16.51,124.46 v12.7,123.19 | v16.51,22.86 30.48,22.86 34.29,24.13 48.26,24.13 50.8,25.4 v55.88,25.4 | E4.4 87.63,95.25 71.12,95.25 66.04,92.71 43.18,92.71 v38.1,93.98
MA2_L  (via drill 0.81)
  Top 0.406: U$1.BV1 116.84,3.81 104.14,3.81 97.79,1.27 20.32,1.27 11.43,8.89 11.43,20.32 v13.97,22.86 5.08,29.21 5.08,39.37 7.62,41.91 7.62,69.85 8.89,71.12 8.89,121.92 11.43,124.46 17.78,124.46 E3.13 22.86,119.38 35.56,119.38 36.83,120.65 39.37,120.65 40.64,119.38 40.64,115.57 R2.1 | E17.8 69.85,34.29 74.93,31.75 74.93,29.21 v68.58,24.13
  Bottom 0.406: v13.97,22.86 15.24,24.13 30.48,24.13 34.29,25.4 48.26,25.4 50.8,26.67 64.77,26.67 v68.58,24.13
MA3_H  (via drill 0.81)
  Top 0.406: E19.4 86.36,8.89 55.88,8.89 53.34,11.43 53.34,25.4 55.88,27.94 62.23,27.94 E17.5 | v21.59,26.67 20.32,25.4 15.24,25.4 7.62,31.75 7.62,39.37 10.16,41.91 10.16,69.85 11.43,71.12 v11.43,85.09 11.43,114.3 15.24,118.11 24.13,118.11 E3.5
  Bottom 0.406: E19.4 92.71,10.16 100.33,10.16 105.41,12.7 105.41,19.05 107.95,22.86 116.84,22.86 U$1.BN2 | E17.5 63.5,31.75 53.34,31.75 48.26,27.94 34.29,27.94 30.48,26.67 v21.59,26.67 | R6.1 15.24,74.93 11.43,78.74 v11.43,85.09
MA3_L  (via drill 0.81)
  Top 0.406: v19.05,26.67 15.24,26.67 8.89,31.75 8.89,39.37 11.43,41.91 11.43,69.85 12.7,71.12 v12.7,87.63 12.7,114.3 15.24,116.84 20.32,116.84 E3.3
  Bottom 0.406: U$1.BK2 115.57,33.02 107.95,33.02 102.87,27.94 95.25,26.67 82.55,26.67 77.47,27.94 69.85,27.94 E17.6 64.77,27.94 50.8,27.94 48.26,26.67 34.29,26.67 30.48,25.4 21.59,25.4 v19.05,26.67 | R5.1 34.29,76.2 15.24,76.2 12.7,78.74 v12.7,87.63
MB2_H  (via drill 0.81)
  Top 0.406: v41.91,95.25 40.64,93.98 40.64,77.47 v41.91,76.2 41.91,71.12 43.18,69.85 43.18,64.77 41.91,63.5 41.91,48.26 v40.64,46.99
  Bottom 0.406: E21.12 E21.13 15.24,16.51 12.7,16.51 11.11,18.1 11.11,36.51 12.7,39.37 13.97,40.64 16.51,41.91 24.13,43.18 26.67,44.45 E15.5 29.21,44.45 34.29,44.45 36.83,46.99 v40.64,46.99 46.99,46.99 52.07,41.91 64.77,41.91 69.85,45.72 E13.1 | E4.2 83.82,96.52 71.12,96.52 66.04,93.98 45.72,93.98 v41.91,95.25 | E11.9 63.5,72.39 53.34,72.39 48.26,73.66 44.45,73.66 v41.91,76.2
MB2_L  (via drill 0.81)
  Top 0.406: E11.8 63.5,67.31 v62.23,67.31 53.34,67.31 49.53,63.5 49.53,62.23 45.72,58.42 45.72,25.4 41.91,21.59 v41.91,19.05
  Bottom 0.406: v41.91,19.05 40.64,16.51 36.83,16.51 34.29,13.97 30.48,13.97 E21.9 E21.10 19.05,13.97 12.7,13.97 10.16,16.51 10.16,36.83 11.43,39.37 13.97,41.91 16.51,43.18 21.59,44.45 E15.3 | E10.1 67.31,67.31 v62.23,67.31
MB3_H  (via drill 0.81)
  Top 0.406: v78.74,10.16 82.55,10.16 E19.2 | v29.21,49.53 21.59,52.07 E15.13 | E11.5 59.69,60.96 50.8,60.96 46.99,57.15 v46.99,50.8
  Bottom 0.406: v78.74,10.16 74.93,7.62 52.07,7.62 50.8,6.35 20.32,6.35 E21.2 E21.1 7.62,16.51 7.62,38.1 16.51,49.53 E15.13 | E13.8 95.25,49.53 49.53,49.53 v46.99,50.8 39.37,53.34 36.83,53.34 34.29,50.8 v29.21,49.53
MB3_L  (via drill 0.81)
  Top 0.406: E11.6 60.96,59.69 50.8,59.69 49.53,58.42 49.53,26.67 43.18,20.32 43.18,16.51 v41.91,15.24
  Bottom 0.406: v41.91,15.24 36.83,15.24 34.29,12.7 26.67,12.7 E21.5 E21.4 19.05,12.7 12.7,12.7 8.89,16.51 8.89,36.83 10.16,39.37 13.97,44.45 17.78,48.26 22.86,50.8 29.21,52.07 E15.9 | E11.6 66.04,62.23 93.98,62.23 E10.6
MB_2  (via drill 0.81)
  Top 0.406: U$1.BF1 116.84,41.91 110.49,41.91 v107.95,44.45 | v76.2,40.64 76.2,36.83 78.74,34.29 78.74,29.21 76.2,26.67 76.2,22.86 69.85,16.51 55.88,16.51 v54.61,15.24
  Bottom 0.406: E21.8 31.75,15.24 34.29,15.24 34.29,17.78 R11.1 43.18,20.32 44.45,19.05 44.45,16.51 46.99,15.24 v54.61,15.24 | v107.95,44.45 105.41,44.45 100.33,41.91 96.52,41.91 95.25,40.64 v76.2,40.64
MB_3
  Bottom 0.406: E21.6 27.94,8.89 34.29,8.89 R13.1 39.37,11.43 49.53,11.43 53.34,8.89 74.93,8.89 77.47,11.43 80.01,11.43 91.44,7.62 100.33,7.62 105.41,10.16 107.95,12.7 107.95,15.24 109.22,16.51 116.84,16.51 U$1.BR2
MEM2
  Top 0.406: E4.10 93.98,106.68 101.6,106.68 105.41,102.87 111.76,99.06 116.84,99.06 U$1.AL1
  Bottom 0.406: R1.1 87.63,107.95 91.44,106.68 E4.10
MEM3  (via drill 0.81)
  Top 0.406: U$1.BL1 116.84,29.21 110.49,29.21 v109.22,30.48
  Bottom 0.406: R4.1 87.63,24.13 92.71,21.59 | 92.71,21.59 E19.10 | v109.22,30.48 102.87,26.67 96.52,25.4 92.71,21.59
MQ2
  Bottom 0.406: E7.13 86.36,87.63 100.33,87.63 102.87,90.17 106.68,90.17 109.22,88.9 111.76,86.36 116.84,86.36 U$1.AR2
MQ3  (via drill 0.81)
  Top 0.406: U$1.BJ1 116.84,35.56 110.49,35.56 v109.22,36.83
  Bottom 0.406: E16.13 86.36,36.83 v109.22,36.83
N$1
  Top 0.406: E10.10 87.63,66.04 81.28,66.04 80.01,64.77 80.01,62.23 81.28,60.96 86.36,60.96 E13.10 92.71,52.07 86.36,52.07 81.28,46.99 81.28,36.83 82.55,35.56 87.63,35.56 E16.11
N$2
  Top 0.406: E16.12 82.55,43.18 82.55,46.99 86.36,50.8 93.98,50.8 E13.9 87.63,62.23 81.28,62.23 81.28,64.77 88.9,64.77 E10.9
N$3
  Top 0.406: E4.11 93.98,109.22 100.33,109.22 102.87,113.03 102.87,115.57 101.6,116.84 95.25,116.84 E1.11
N$4
  Top 0.406: E4.12 93.98,111.76 97.79,111.76 99.06,113.03 99.06,115.57 93.98,115.57 E1.12
N$5
  Top 0.406: E7.12 90.17,86.36 95.25,86.36 99.06,82.55 99.06,80.01 97.79,78.74 92.71,78.74 E10.12 85.09,68.58 81.28,68.58 77.47,64.77 77.47,62.23 81.28,58.42 83.82,58.42 E13.12
N$6
  Top 0.406: E7.11 91.44,87.63 95.25,87.63 100.33,82.55 100.33,80.01 97.79,77.47 93.98,77.47 E10.11 86.36,67.31 81.28,67.31 78.74,64.77 78.74,62.23 81.28,59.69 85.09,59.69 E13.11
N$7
  Bottom 0.406: E20.12 59.69,19.05 60.96,17.78 71.12,17.78 74.93,20.32 78.74,20.32 81.28,21.59 86.36,21.59 E19.12
N$8
  Bottom 0.406: E20.11 63.5,19.05 71.12,19.05 74.93,21.59 78.74,21.59 81.28,22.86 87.63,22.86 E19.11
N$9  (via drill 0.81)
  Top 0.406: E3.9 25.4,127 v12.7,127 | v13.97,91.44 13.97,88.9 16.51,86.36 24.13,86.36 E9.11
  Bottom 0.406: E3.9 31.75,123.19 63.5,123.19 E2.9 | v12.7,127 10.16,124.46 10.16,120.65 12.7,118.11 12.7,93.98 v13.97,91.44
N$10
  Top 0.406: E3.4 22.86,111.76 20.32,111.76 16.51,107.95 16.51,96.52 17.78,95.25 25.4,95.25 E6.5 E9.8
N$19
  Top 0.406: E9.3 21.59,81.28 16.51,81.28 15.24,80.01 15.24,68.58 17.78,66.04 20.32,66.04 E12.3
N$20
  Top 0.406: E12.9 E9.6
NO_ROT
  Bottom 0.406: U$1.AJ2 115.57,105.41 111.76,105.41 109.22,109.22 107.95,109.22 104.14,107.95 93.98,107.95 86.36,111.76 62.23,111.76 E2.4 55.88,110.49 35.56,110.49 31.75,107.95 E6.9
PC2_H  (via drill 0.81)
  Top 0.406: v43.18,58.42 43.18,63.5 44.45,64.77 44.45,69.85 43.18,71.12 43.18,77.47 41.91,78.74 41.91,87.63 43.18,88.9 43.18,109.22 45.72,111.76 45.72,123.19 44.45,124.46 44.45,125.73 45.72,127 v54.61,127
  Bottom 0.406: E1.10 93.98,120.65 99.06,120.65 100.33,121.92 100.33,123.19 96.52,125.73 91.44,127 v54.61,127 | E14.9 60.96,55.88 49.53,55.88 v43.18,58.42
PC2_L  (via drill 0.81)
  Top 0.406: U$1.BB1 116.84,54.61 110.49,54.61 106.68,58.42 106.68,60.96 v107.95,62.23
  Bottom 0.406: E14.8 67.31,54.61 71.12,58.42 100.33,58.42 v107.95,62.23
PC3_H  (via drill 0.81)
  Top 0.406: v50.8,22.86 50.8,40.64 v53.34,43.18
  Bottom 0.406: E20.10 66.04,22.86 66.04,24.13 64.77,25.4 60.96,25.4 57.15,22.86 v50.8,22.86 | E14.5 60.96,44.45 54.61,44.45 v53.34,43.18
PC3_L  (via drill 0.81)
  Top 0.406: E14.6 v69.85,40.64
  Bottom 0.406: U$1.BE2 116.84,45.72 105.41,45.72 100.33,43.18 96.52,43.18 95.25,41.91 71.12,41.91 v69.85,40.64
PS_2  (via drill 0.81)
  Top 0.406: v26.67,59.69 E12.5 22.86,68.58 17.78,68.58 16.51,69.85 16.51,78.74 E9.1 | E1.8 101.6,121.92 105.41,118.11 105.41,107.95 v107.95,105.41 | v43.18,86.36 44.45,87.63 v44.45,101.6
  Bottom 0.406: U$1.BT2 116.84,10.16 110.49,10.16 97.79,3.81 20.32,3.81 13.97,6.35 5.08,15.24 5.08,38.1 15.24,57.15 20.32,59.69 v26.67,59.69 | E9.1 E9.2 24.13,83.82 35.56,83.82 38.1,86.36 v43.18,86.36 | v107.95,105.41 E4.8 96.52,104.14 73.66,104.14 72.39,102.87 57.15,102.87 E5.13 50.8,101.6 v44.45,101.6
PS_3  (via drill 0.81)
  Top 0.406: 97.79,24.13 v92.71,24.13 | 97.79,24.13 E19.8 | 97.79,24.13 100.33,24.13 105.41,29.21 105.41,54.61 103.82,56.2 103.82,65.72 v105.41,67.31 | E9.5 E9.4 E12.13 | v45.72,83.82 46.99,85.09 v46.99,97.79 | v72.39,69.85 72.39,74.93 73.66,76.2 73.66,93.98 68.58,99.06 58.42,99.06 E5.3
  Bottom 0.406: U$1.BV2 115.57,3.81 104.14,3.81 97.79,1.27 20.32,1.27 13.97,3.81 2.54,15.24 2.54,38.1 10.16,52.07 10.16,62.23 11.43,64.77 12.7,66.04 16.51,67.31 19.05,68.58 20.32,69.85 E12.13 | E20.8 69.85,24.13 71.12,25.4 88.9,25.4 v92.71,24.13 | E9.5 30.48,82.55 35.56,82.55 38.1,85.09 41.91,85.09 v45.72,83.82 | v46.99,97.79 48.26,99.06 55.88,99.06 E5.3 | v105.41,67.31 95.25,67.31 92.71,66.04 80.01,66.04 76.2,67.31 v72.39,69.85
PS_LEFT_2  (via drill 0.81)
  Top 0.406: v49.53,88.9 49.53,102.87 v48.26,104.14
  Bottom 0.406: v49.53,88.9 66.04,88.9 71.12,91.44 95.25,91.44 E7.8 99.06,92.71 100.33,93.98 104.14,93.98 111.76,90.17 116.84,90.17 U$1.AP2 | v48.26,104.14 E5.14
PS_LEFT_3  (via drill 0.81)
  Top 0.406: E16.8 101.6,41.91 101.6,54.61 100.33,55.88 100.33,68.58 v102.87,71.12 | v73.66,72.39 74.93,73.66 74.93,93.98 73.66,95.25 73.66,99.06 72.39,100.33 57.15,100.33 E5.2
  Bottom 0.406: U$1.BH2 116.84,39.37 110.49,39.37 109.22,40.64 105.41,40.64 100.33,38.1 E16.8 | v102.87,71.12 100.33,68.58 95.25,68.58 92.71,67.31 80.01,67.31 v73.66,72.39
REG_BUS2
  Top 0.406: E17.12 60.96,39.37 71.12,39.37 71.12,44.45 68.58,46.99 68.58,50.8 | E14.12 58.42,54.61 68.58,54.61 68.58,50.8 | E11.12 59.69,73.66 69.85,73.66 | 69.85,73.66 72.39,76.2 72.39,88.9 71.12,90.17 59.69,90.17 E8.12 54.61,85.09 50.8,85.09 48.26,87.63 48.26,99.06 45.72,101.6 45.72,110.49 55.88,120.65 66.04,120.65 E2.8 73.34,127.95 101.92,127.95 111.76,118.11 116.84,118.11 U$1.AD1 | 69.85,73.66 69.85,59.69 73.66,55.88 73.66,52.07 72.39,50.8 68.58,50.8
REG_BUS3  (via drill 0.81)
  Top 0.406: E17.2 57.15,33.02 53.34,36.83 53.34,39.37 54.61,40.64 E14.2 50.8,49.53 50.8,57.15 v52.07,58.42 | v31.75,93.98 34.29,96.52 34.29,99.06 33.02,100.33 E6.8 | v15.24,63.5 13.97,64.77 13.97,82.55 v15.24,83.82
  Bottom 0.406: E11.2 v52.07,58.42 43.18,60.96 16.51,60.96 v15.24,63.5 | 54.61,78.74 50.8,78.74 48.26,81.28 38.1,81.28 34.29,78.74 16.51,78.74 15.24,80.01 v15.24,83.82 15.24,88.9 16.51,90.17 v31.75,93.98 | 54.61,78.74 E8.2 | 54.61,78.74 58.42,76.2 66.04,76.2 67.31,77.47 74.93,77.47 80.01,73.66 82.55,73.66 85.09,74.93 110.49,74.93 111.76,73.66 116.84,73.66 U$1.AV2
ROT_LEFT
  Top 0.406: E2.2 58.42,118.11 72.39,118.11 74.93,120.65 74.93,121.92 78.74,125.73 101.6,125.73 109.22,118.11 109.22,114.3 111.76,111.76 116.84,111.76 U$1.AF1
  Bottom 0.406: E2.2 53.34,115.57 49.53,115.57 46.99,114.3 39.37,114.3 35.56,116.84 17.78,116.84 16.51,115.57 15.24,107.95 15.24,97.79 17.78,95.25 20.32,95.25 E6.3
ROT_RIGHT
  Top 0.406: E2.1 57.15,119.38 72.39,119.38 73.66,120.65 73.66,121.92 78.74,127 101.6,127 110.49,118.11 110.49,116.84 110.49,115.57 111.76,115.57 116.84,115.57 U$1.AE1
  Bottom 0.406: E6.13 22.86,107.95 29.21,111.76 36.83,113.03 50.8,113.03 E2.1
RS_MSC2
  Top 0.406: E1.2 E1.3
  Bottom 0.406: U$1.AF2 116.84,111.76 110.49,111.76 104.14,110.49 93.98,110.49 E1.3
RS_MSC3
  Top 0.406: U$1.BN1 116.84,22.86 107.95,22.86 102.87,16.51 82.55,16.51 76.2,10.16 62.23,10.16 E20.3
  Bottom 0.406: E20.2 E20.3
RSW2
  Bottom 0.406: U$1.AE2 116.84,115.57 110.49,115.57 104.14,111.76 93.98,111.76 E1.4
RSW3
  Top 0.406: E20.4 63.5,11.43 72.39,11.43 73.66,12.7 77.47,12.7 82.55,17.78 97.79,17.78 106.68,26.67 116.84,26.67 U$1.BM1
VCC  (via drill 0.81)
  Top 0.813: E2.14 R3.2 | R11.2 R12.2 46.99,15.24 41.91,10.16 44.45,7.62 R14.2 R13.2 | R4.2 58.42,24.13 E20.14 | R7.2 R10.2 R9.2 R8.2 | R6.2 R5.2 | C3.1 C6.1 39.37,101.6 39.37,97.79 36.83,95.25 36.83,88.9 C9.1 34.29,78.74 34.29,74.93 C12.1 | C7.1 C4.1 | E14.14 54.61,55.88 69.85,55.88 C14.1 C13.1 | C18.1 33.02,40.01 38.1,45.09 v38.1,45.72 38.1,48.26 40.64,50.8 40.64,54.61 39.37,55.88 | C11.1 41.91,68.58 41.91,66.04 39.37,63.5 39.37,55.88 | 39.37,55.88 C15.1 | E8.14 E5.4 | v69.85,76.2 69.85,80.01 68.58,81.28 68.58,83.82 71.12,86.36 C8.1
  Bottom 0.813: 13.97,19.05 E21.14 | 13.97,19.05 15.24,20.32 30.48,20.32 33.02,19.05 | 33.02,19.05 C21.1 | U$1.AA2 116.84,128.27 109.22,128.27 C1.1 82.55,119.38 | E3.14 20.32,119.38 33.02,119.38 35.56,121.92 40.64,121.92 C3.1 E2.14 54.61,119.38 69.85,119.38 C2.1 74.93,120.65 76.2,119.38 82.55,119.38 | C19.1 99.06,16.51 87.63,16.51 E19.14 C20.1 58.42,16.51 E20.14 R11.2 44.45,22.86 36.83,22.86 33.02,19.05 | R6.2 49.53,74.93 54.61,73.66 67.31,73.66 69.85,71.12 67.31,68.58 54.61,68.58 E11.14 48.26,72.39 40.64,72.39 C11.1 C12.1 34.29,73.66 20.32,73.66 E12.14 | 71.12,105.41 67.31,107.95 R1.2 R2.2 C6.1 34.29,102.87 20.32,102.87 E6.14 | 71.12,105.41 C5.1 | C10.1 85.09,73.66 E10.14 80.01,71.12 74.93,76.2 v69.85,76.2 | 13.97,19.05 12.38,20 12.38,35.24 E18.14 17.78,40.64 22.86,40.64 35.56,43.18 v38.1,45.72 | C16.1 85.09,35.56 E16.14 76.2,38.1 C17.1 57.15,35.56 E17.14 49.53,38.1 R10.2 40.64,36.83 C18.1 | 71.12,105.41 E4.14 | 82.55,119.38 E1.14 | U$1.BA2 115.57,58.42 109.22,58.42 101.6,55.88 86.36,55.88 E13.14 C13.1 | E14.14 44.45,55.88 C15.1 20.32,55.88 E15.14 | E9.14 20.32,85.09 34.29,85.09 C9.1 39.37,88.9 44.45,88.9 48.26,86.36 50.8,86.36 E8.14 54.61,85.09 68.58,85.09 C8.1 72.39,88.9 E7.14 85.09,86.36 101.6,86.36 C7.1

### Text on the board
Top: FLIP CHIP
Bottom: MAIN REGISTER M221D